# Altium project Linear Actuator V3.1.PrjPcb
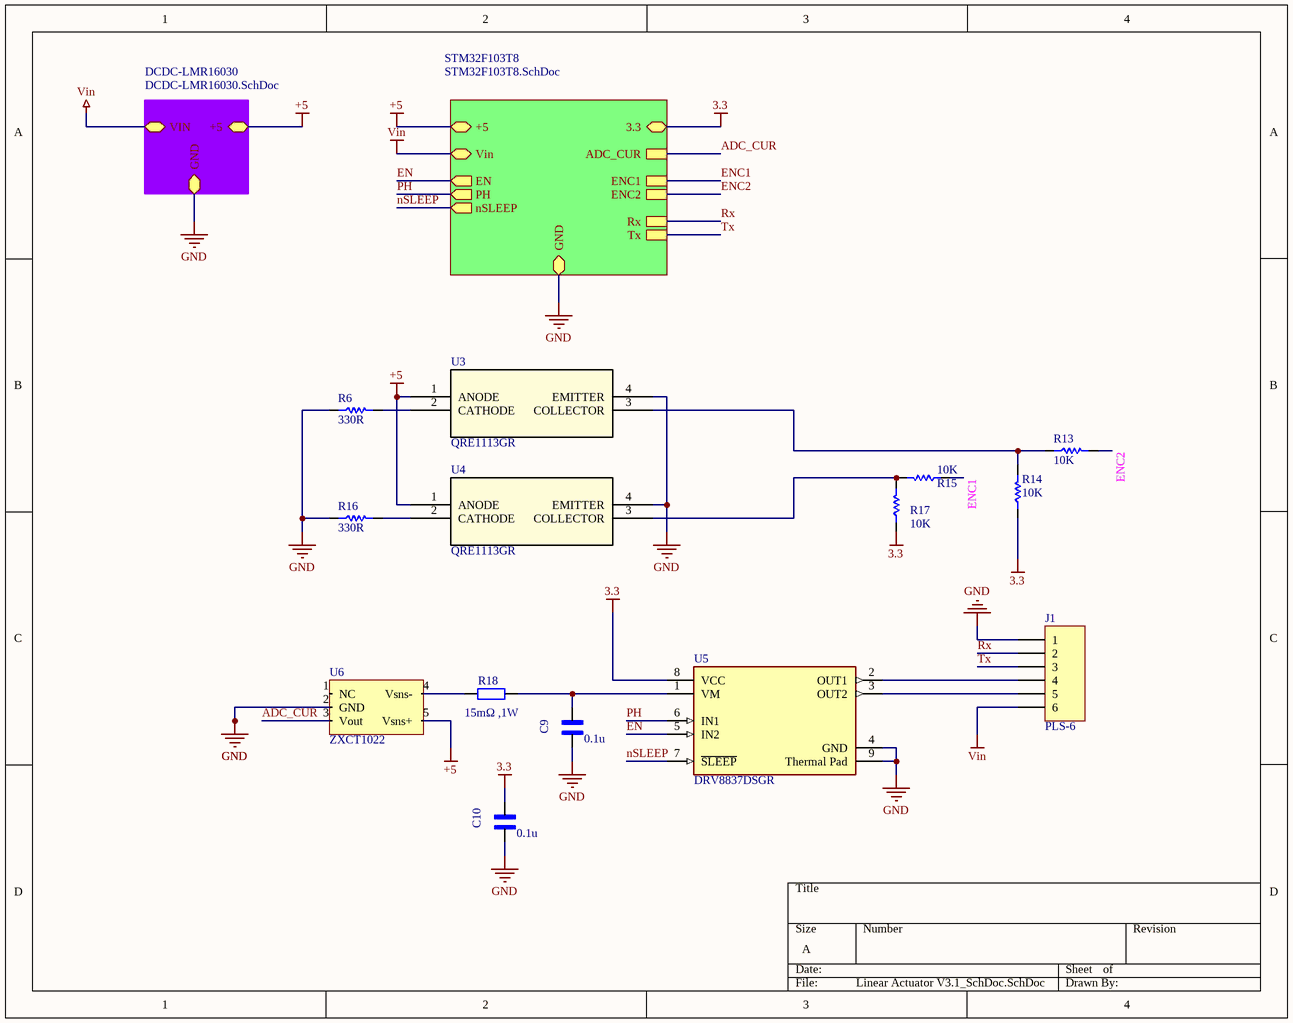
[diagram p0: Linear Actuator V3.1_SchDoc.SchDoc]
Date: 2/2/2022; Engineer: Ehsan Shaghaei
3 sheets, 50 parts. Net scope: hierarchical (ports join the sheet entries above them; power ports are global).
Board file: Linear Actuator V3.1_PcbDoc.PcbDoc
Sheets:
  Linear Actuator V3.1_SchDoc.SchDoc
    DCDC-LMR16030 = DCDC-LMR16030.SchDoc
    STM32F103T8 = STM32F103T8.SchDoc

## Sheet Linear Actuator V3.1_SchDoc.SchDoc
size A; SheetNumber: 1; SheetTotal: 3

### Parts
C9  value 0.1u  [*CAPC1608X90]  (hidden comment: GX035C104MAT2-500)
C10  value 0.1u  [*CAPC1608X90]  (hidden comment: GX035C104MAT2-500)
J1  PLS-6  [HDR Side 6 pin]
R6  330R  [RES 0603 (1608X06L)]
R13  10K  [RES 0603 (1608X06L)]
R14  10K  [RES 0603 (1608X06L)]
R15  10K  [RES 0603 (1608X06L)]
R16  330R  [RES 0603 (1608X06L)]
R17  10K  [RES 0603 (1608X06L)]
R18  value 15mΩ ,1W  [RES2512]  (hidden comment: resistor)
U3  QRE1113GR  [SMD4_2P90X3P60_ONS]
U4  QRE1113GR  [SMD4_2P90X3P60_ONS]
U5  DRV8837DSGR  [FP-DSG0008A-MFG]
U6  ZXCT1022  [SOT23-5]

### Sub-sheets
DCDC-LMR16030 = DCDC-LMR16030.SchDoc: GND (bidir), VIN (bidir), +5 (bidir)
STM32F103T8 = STM32F103T8.SchDoc: GND (bidir), +5 (bidir), 3.3 (bidir), Vin (bidir), ADC_CUR, ENC1, ENC2, EN (out), PH (out), nSLEEP (out), Rx, Tx

### Nets
3.3: C10.1 R14.1 R17.1 U5.8(VCC) ; sheet STM32F103T8/3.3
+5: U3.1(ANODE) U4.1(ANODE) U6.5(Vsns+) ; sheet DCDC-LMR16030/+5, sheet STM32F103T8/+5
GND: C9.2 C10.2 J1.1 R6.1 R16.1 U3.4(EMITTER) U4.4(EMITTER) U5.4(GND) U5.9(Thermal_Pad) U6.2(GND) ; sheet DCDC-LMR16030/GND, sheet STM32F103T8/GND
Vin: J1.6 ; sheet DCDC-LMR16030/VIN, sheet STM32F103T8/Vin
ADC_CUR: U6.3(Vout) ; sheet STM32F103T8/ADC_CUR
EN: U5.5(IN2) ; sheet STM32F103T8/EN
ENC1: R15.1 ; sheet STM32F103T8/ENC1
ENC2: R13.2 ; sheet STM32F103T8/ENC2
nSLEEP: U5.7(~{SLEEP}) ; sheet STM32F103T8/nSLEEP
PH: U5.6(IN1) ; sheet STM32F103T8/PH
Rx: J1.2 ; sheet STM32F103T8/Rx
Tx: J1.3 ; sheet STM32F103T8/Tx
NetC9_1: C9.1 R18.2 U5.1(VM)
NetJ1_4: J1.4 U5.2(OUT1)
NetJ1_5: J1.5 U5.3(OUT2)
NetR6_2: R6.2 U3.2(CATHODE)
NetR13_1: R13.1 R14.2 U3.3(COLLECTOR)
NetR15_2: R15.2 R17.2 U4.3(COLLECTOR)
NetR16_2: R16.2 U4.2(CATHODE)
NetR18_1: R18.1 U6.4(Vsns-)

Not connected (* = marked no-connect by the designer): U6 1(NC)

### Library data of the parts
C9 C10 = GX035C104MAT2-500: Cap Thin Film 0.1uf 50v 0603; MF: AVX; MP: GX035C104MAT2-500 or CL10B104JB8NNNC; Pacage Metric: 1608; Type: SMD; Package: 0603 AVX; SnapEDA_Link: https://www.snapeda.com/parts/GX035C104MAT2-500/AVX/view-part/?ref=snap
J1 = PLS-6: PLS-6 (DS1021-1x6), Вилка штыревая 2.54мм 1x6 прямая тип1; Instructions: DNP; ChipDip_Link: https://www.chipdip.ru/product/pls-6; MP: PLS-6; Type: SMD
R6 R13-R17 = Resistor: Tolerance: 5%; Power: 1/8 W
  R6 R16: Value: 330R
  R13-R15 R17: Value: 10K
U3 U4 = QRE1113GR: No Description Available; Vendor: ON Semiconductor; Built_By: Ehsan Shaghaei; SourceLibrary: ON_Semiconductor_2019-12-30; Manufacturer_Part_Number: QRE1113GR; Copyright: Copyright (C) 2018 Accelerated Designs. All rights reserved; RefDes: RefDes; Type: DEV; ComponentLink1Description: New link; ComponentLink1URL: *; ChipDip_Link: https://www.chipdip.ru/product/qre1113gr-fairchild
U5 = CMP-04915-000004-1: IC MOTOR DRIVER PAR 8WSON; Manufacturer: Texas Instruments; Switching Frequency: 0-250kHz; Min Supply Voltage: 1.8V; Standoff Height: 0mm; Max Supply Voltage: 7V; Output Voltage: 0-11V; Motor Type: Brushed; Number Of Outputs: 2; Output Current: 1.8A; Max Junction Temp: +150°C; Nominal Supply Current: 300-700uA; Mouser Description: Motor / Motion / Ignition Controllers & Drivers 1.8A Low Vltg Brush DC Motor Driver; Device Class L2: Power Management ICs; Manufacturer Part Number: DRV8837DSGR; Temperature Range Low: -40°C; Lead Free: Yes; Height: 0.8mm; Device Class L3: Motor Drivers; Octopart: https://octopart.com/drv8837dsgr-texas+instruments-23786726; Package: DSG0008A; ComponentLink2URL: https://www.chipdip.ru/product0/8004320325; Temperature: -40°C to +85°C; Ambient Temperature Range Low: -40°C; ComponentLink2Description: ChipDip_Link; Ambient Temperature Range High: +85°C; Device Class L1: Integrated Circuits (ICs); Category: IC; Temperature Range High: +85°C; RoHS: TRUE; Automotive: No; Digikey Description: IC MOTOR DRIVER PAR 8WSON; ComponentLink3Description: HelpURL; ComponentLink3URL: http://www.ti.com/lit/ds/symlink/drv8837.pdf
R18 = resistor: Published: 8-Jun-2000; LatestRevisionDate: 17-Jul-2002; LatestRevisionNote: Re-released for DXP Platform.; PackageReference: AXIAL-0.4; Publisher: Altium Limited
U6 = ZXCT1022: HelpURL: https://static.chipdip.ru/lib/465/DOC012465896.pdf; Chipdip_Link: https://www.chipdip.ru/product/zxct1022e5ta-current-sense-monitor-2.5

## Sheet DCDC-LMR16030.SchDoc
size A3; Engineer: Ehsan Shaghaei; Revision: 9; SheetNumber: 3; SheetTotal: 3
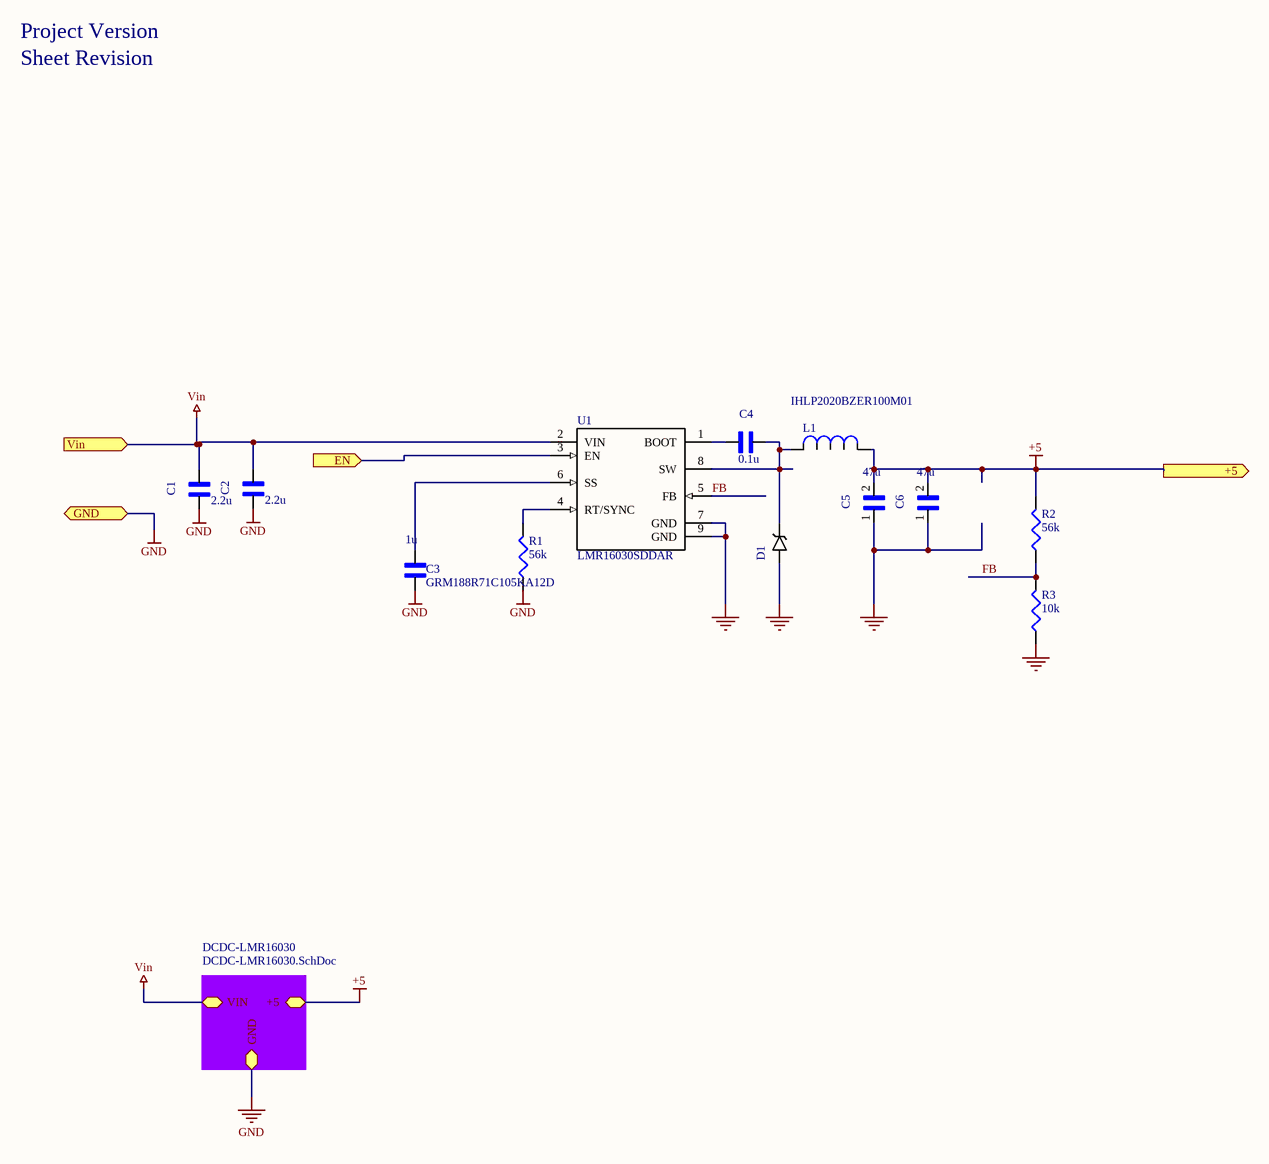
[diagram p1: DCDC-LMR16030.SchDoc]

### Parts
(Parts that share a designator on the sheet are numbered #1, #2 ... from top to bottom, then left to right.)
C1#1  value 2.2u  [*CAP3216X125N]  (hidden comment: GRM31CR71H225KA88L)
C2#1  value 2.2u  [*CAP3216X125N]  (hidden comment: GRM31CR71H225KA88L)
C3#1  GRM188R71C105KA12D  value 1u  [CAPC1608X90N]
C4#1  value 0.1u  [*CAPC1608X90]  (hidden comment: GX035C104MAT2-500)
C5#1  value 47u  [*CAPC3216X125N]  (hidden comment: GRM31CR61A476KE15L)
C6#1  value 47u  [*CAPC3216X125N]  (hidden comment: GRM31CR61A476KE15L)
D1#1  SK56  [*SMB_P6SMB62AT3G(Primary)]  (value not drawn)
L1  IHLP2020BZER100M01  [IHLP]
R1  value 56k  [J1-0603]  (hidden comment: Res3)
R2  value 56k  [J1-0603]  (hidden comment: Res3)
R3  value 10k  [J1-0603]  (hidden comment: RC0603FR-0710KL)
U1#1  LMR16030SDDAR  [*SOIC127P600X170-9N - duplicate]

### Sub-sheets
DCDC-LMR16030 = DCDC-LMR16030.SchDoc: GND (bidir), VIN (bidir), +5 (bidir)

### Ports
+5 (out), EN (in), GND (bidir), Vin (in)

### Nets
+5: C5#1.2 C6#1.2 L1.1 R2.2 ; port +5, sheet DCDC-LMR16030/+5
GND: C1#1.2 C2#1.2 C3#1.1 C5#1.1 C6#1.1 D1#1.A R1.1 R3.1 U1#1.7(GND) U1#1.9(GND) ; port GND, sheet DCDC-LMR16030/GND
Vin: C1#1.1 C2#1.1 U1#1.2(VIN) ; port Vin, sheet DCDC-LMR16030/VIN
FB: R2.1 R3.2 U1#1.5(FB)
NetC3#1_2: C3#1.2 U1#1.6(SS)
NetC4#1_1: C4#1.1 D1#1.C L1.2 U1#1.8(SW)
NetC4#1_2: C4#1.2 U1#1.1(BOOT)
NetR1_2: R1.2 U1#1.4(RT/SYNC)
NetU1#1_3: U1#1.3(EN) ; port EN

### Notes on the sheet
- Project Version
- Sheet Revision

### Library data of the parts
C1#1 C2#1 = GRM31CR71H225KA88L: 1206 2.2 uF 50 V В±10% Tolerance X7R SMT Multilayer Ceramic Capacitor; MF: Murata Electronics; Type: SMD; Package: 1206 Murata; SnapEDA_Link: https://www.snapeda.com/parts/GRM31CR71H225KA88L/Murata%20Electronics%20North%20America/view-part/?ref=snap; MP: GRM31CR71H225KA88L
C3#1 = GRM188R71C105KA12D: SMD Capacitor X7R(EIA) with Capacitance: 1.0uF Tol. 10%. Rated Voltage: 16Vdc; MF: Murata Electronics; Pacage Metric: 1608; MP: GRM188R71C105KA12D; SnapEDA_Link: https://www.snapeda.com/parts/GRM188R71C105KA12D/Murata%20Electronics%20North%20America/view-part/228340/?ref=snap; Package: 0603; ChipDip_Link: https://www.chipdip.ru/product/grm188r71c105ka12d; HelpURL: https://static.chipdip.ru/lib/428/DOC005428493.pdf; Type: SMD
C4#1 = GX035C104MAT2-500: as C9 on sheet Linear Actuator V3.1_SchDoc; Package: 0603 AVX; SnapEDA_Link: https://www.snapeda.com/parts/GX035C104MAT2-500/AVX/view-part/?ref=snap
C5#1 C6#1 = GRM31CR61A476KE15L: Multilayer Ceramic Capacitor, GRM Series, 47 - F, - 10%, X5R, 10 V, 1206 [3216 Metric]; MF: Murata Electronics; Type: SMD; Package: 1206 Murata Electronics; MP: GRM31CR61A476KE15L; SnapEDA_Link: https://www.snapeda.com/parts/GRM31CR61A476KE15L/Murata%20Electronics%20North%20America/view-part/?ref=snap
D1#1 = SK56: Диод Шоттки 5А 60В [SMB / DO-214AA]; MF: Littelfuse Inc.; Type: SMD; MP: SK56; Package: DO-214 Littelfuse; SnapEDA_Link: https://www.snapeda.com/parts/P6SMB62AT3G/Littelfuse%20Inc./view-part/?ref=snap; Value: *; ChipDip_Link: https://www.chipdip.ru/product/sk56
L1 = IHLP2020BZER100M01: 10ÂµH Shielded Molded Inductor 2.3A 199mOhm Max Nonstandard; MF: Vishay Dale; Type: SMD; SnapEDA_Link: https://www.snapeda.com/parts/IHLP2020BZER100M01/Vishay%20Dale/view-part/44808/?ref=snap; MP: IHLP2020BZER100M01; Value: *; Package: Nonstandard Vishay; HelpURL: http://www.vishay.com/docs/34253/ihlp-2020bz-01.pdf; ChipDip_Link: https://www.chipdip.ru/product/ihlp2020bzer100m11-inductor-ihlp-smd-2020-10
R1 R2 = Res3: Resistor; Pacage Metric: 1608; MP: RC0603FR-0756KL; ChipDip_Link: https://www.chipdip.ru/product0/9000079754; HelpURL: https://www.chipdip.ru/product0/9000079754; Package: R0603; Type: SMD
R3 = RC0603FR-0710KL: 10 kOhms 1 0.1 W 1 10 W Chip Resistor 0603 1608 Metric Thick Film; Pacage Metric: 1608; MF: Yageo or NXP; MP: 10K 1% 0603; ChipDip_Link: https://www.chipdip.ru/product0/9000079736; HelpURL: https://www.chipdip.ru/product0/9000079736; Package: R0603; Type: SMD; SnapEDA_Link: https://www.snapeda.com/parts/RC0603FR-0710KL/Yageo/view-part/?ref=dk&t=RC0603FR-0710KL&con_ref=None
U1#1 = LMR16030SDDAR: LMR16030SDDAR, Conv DC-DC 4.3V to 60V Step Down Single-Out 1V to 50V 3A Automotive 8-Pin HSOP EP T/R; MF: Texas Instruments; SnapEDA_Link: https://www.snapeda.com/parts/TPS54560DDA/Texas%20Instruments/view-part/?ref=snap; MP: LMR16030SDDAR; Package: PowerSOIC-8 Texas Instruments; Value: *; Type: SMD; ChipDip_Link: https://www.chipdip.ru/product1/8003448566; HelpURL: https://www.ti.com/lit/ds/symlink/lmr16030.pdf

## Sheet STM32F103T8.SchDoc
size A3; Revision: 10; SheetNumber: 3; SheetTotal: 3
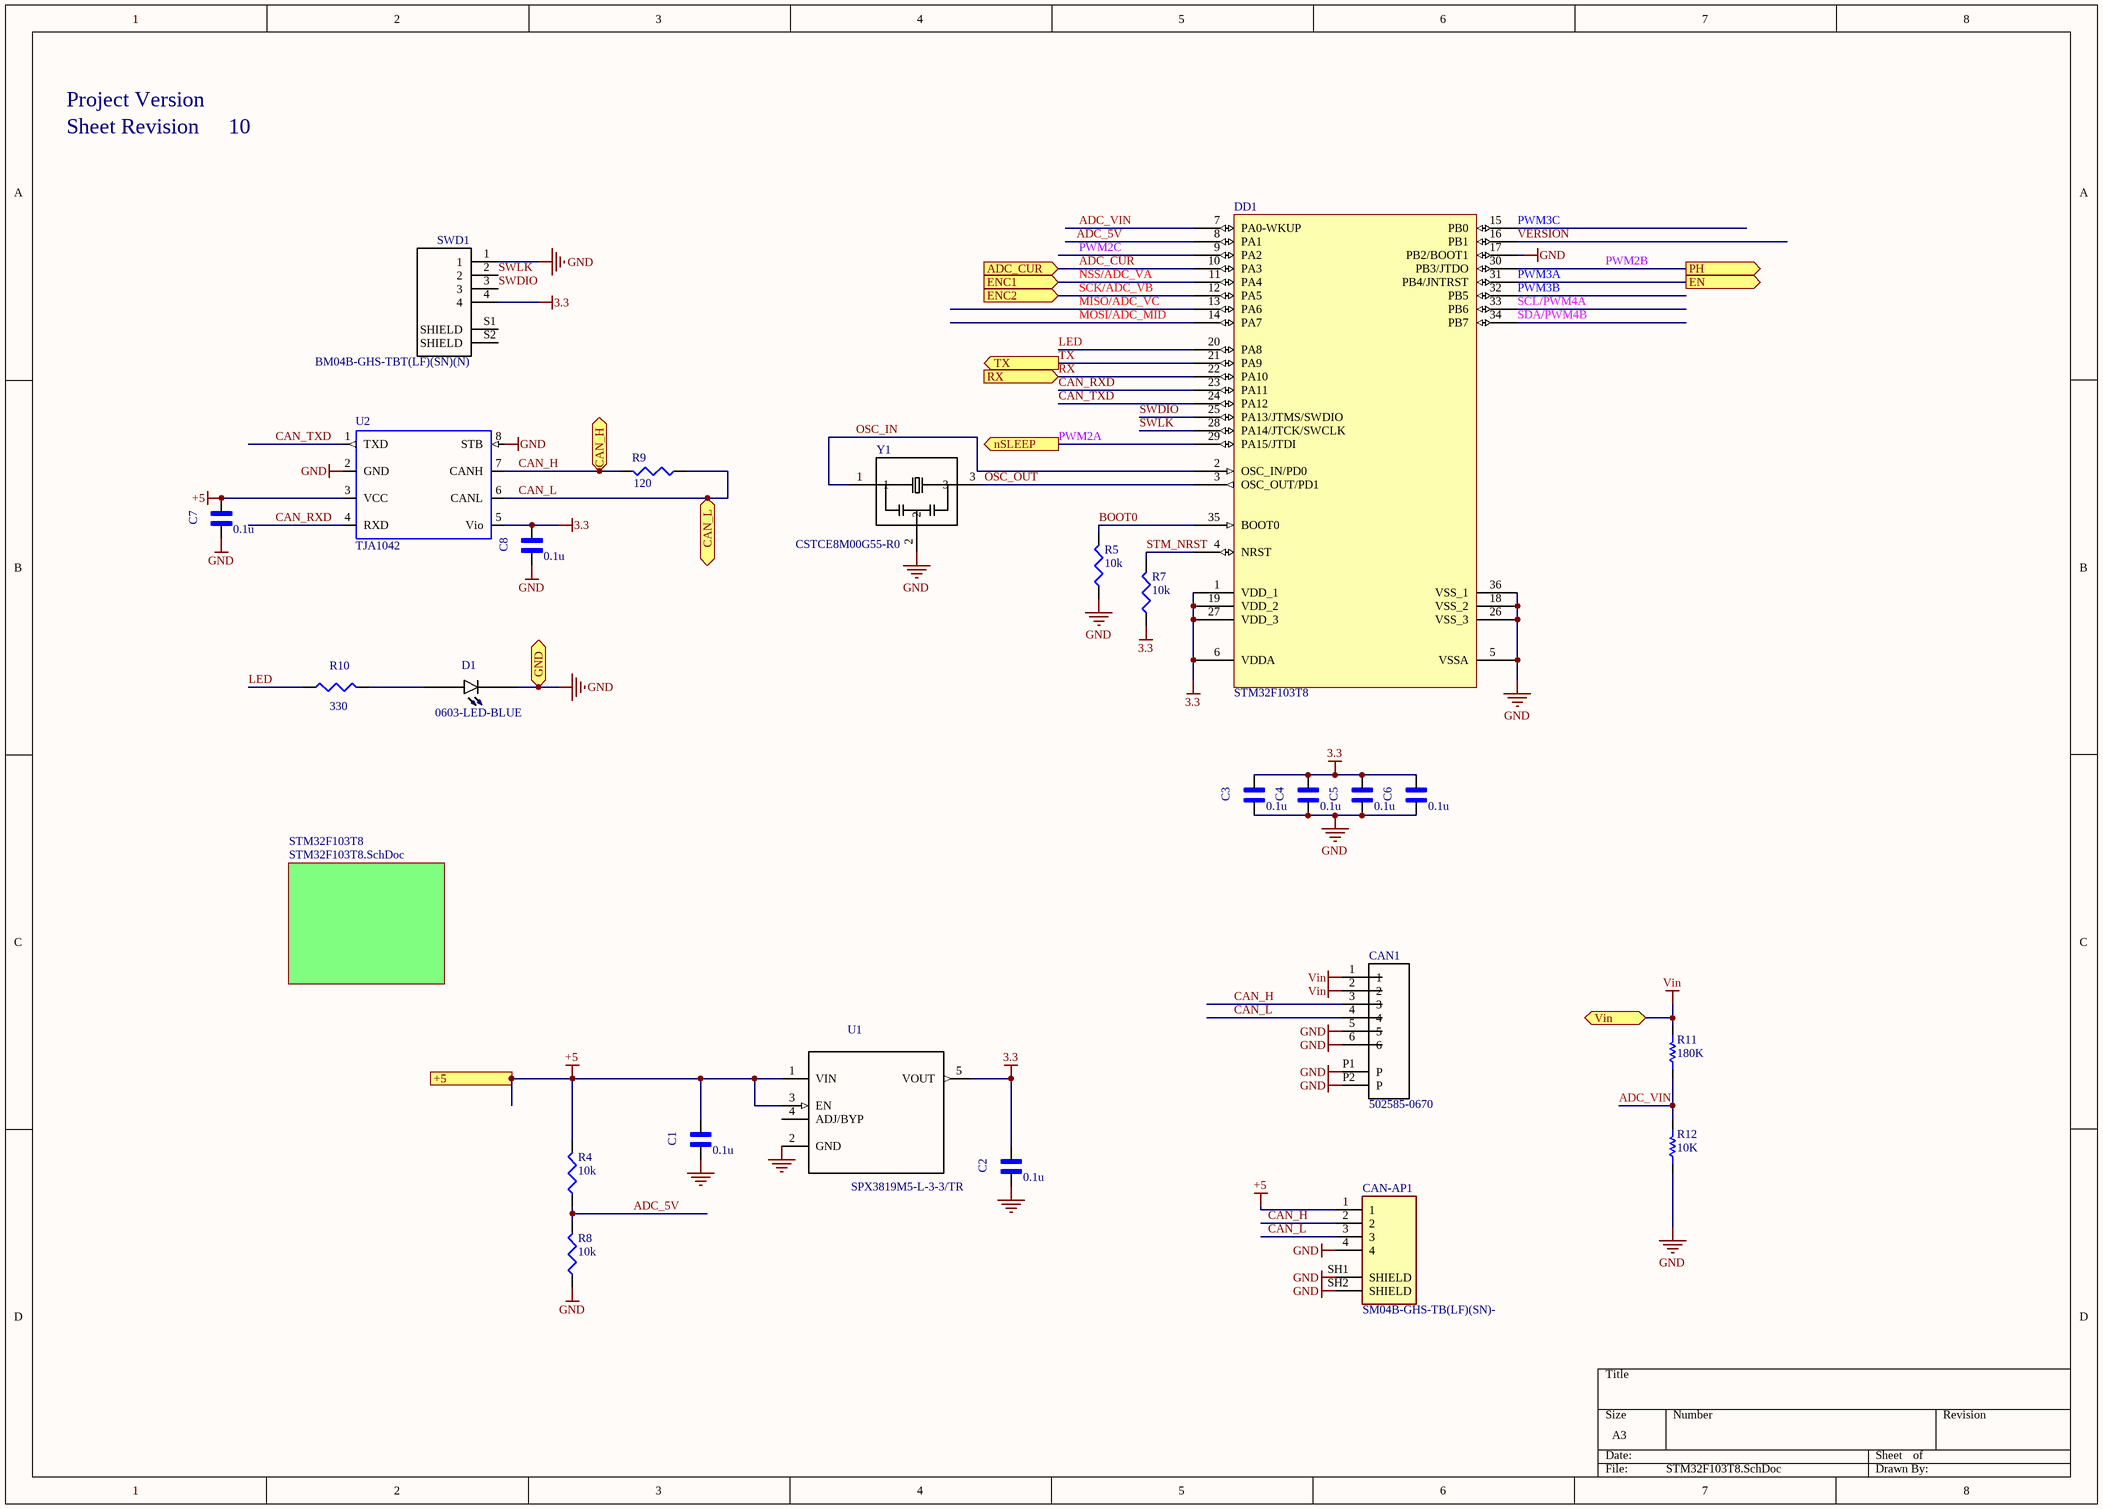
[diagram p2: STM32F103T8.SchDoc]

### Parts
(Parts that share a designator on the sheet are numbered #1, #2 ... from top to bottom, then left to right.)
C1#2  value 0.1u  [*CAPC1608X90]  (hidden comment: GX035C104MAT2-500)
C2#2  value 0.1u  [*CAPC1608X90]  (hidden comment: GX035C104MAT2-500)
C3#2  value 0.1u  [*CAPC1608X90]  (hidden comment: GX035C104MAT2-500)
C4#2  value 0.1u  [*CAPC1608X90]  (hidden comment: GX035C104MAT2-500)
C5#2  value 0.1u  [*CAPC1608X90]  (hidden comment: GX035C104MAT2-500)
C6#2  value 0.1u  [*CAPC1608X90]  (hidden comment: GX035C104MAT2-500)
C7  value 0.1u  [*CAPC1608X90]  (hidden comment: GX035C104MAT2-500)
C8  value 0.1u  [*CAPC1608X90]  (hidden comment: GX035C104MAT2-500)
CAN1  502585-0670  [MOLEX_502585-0670]
CAN-AP1  SM04B-GHS-TB(LF)(SN)-  [JST_SM04B-GHS-TB(LF)(SN)-]
D1#2  0603-LED-BLUE  [*LEDM1608X80_LTE-C1906R-14(Primary)]
DD1  STM32F103T8  [*QFN50P600X600X100-37N]
R4  value 10k  [J1-0603]  (hidden comment: RC0603FR-0710KL)
R5  value 10k  [J1-0603]  (hidden comment: RC0603FR-0710KL)
R7  value 10k  [J1-0603]  (hidden comment: RC0603FR-0710KL)
R8  value 10k  [J1-0603]  (hidden comment: RC0603FR-0710KL)
R9  value 120  [J1-0603]  (hidden comment: Res3)
R10  value 330  [J1-0603]  (hidden comment: Res3)
R11  180K  [RES 0603 (1608X06L)]
R12  10K  [RES 0603 (1608X06L)]
SWD1  BM04B-GHS-TBT(LF)(SN)(N)  [JST_BM04B-GHS-holes]
U1#2  SPX3819M5-L-3-3/TR  [*SOT95P280X145-5N]
U2  TJA1042  [SOT782-1]
Y1  CSTCE8M00G55-R0  [*OSC_CSTCE8M00G55-R0]

### Sub-sheets
STM32F103T8 = STM32F103T8.SchDoc: no entries

### Ports
+5 (in), ADC_CUR (in), CAN_H (bidir), CAN_L (bidir), EN (out), ENC1 (in), ENC2 (in), GND (bidir), nSLEEP (out), PH (out), RX (in), TX (out), Vin (bidir)

### Nets
3.3: C2#2.1 C3#2.1 C4#2.1 C5#2.1 C6#2.1 C8.1 DD1.1(VDD_1) DD1.6(VDDA) DD1.19(VDD_2) DD1.27(VDD_3) R7.1 SWD1.4 U1#2.5(VOUT) U2.5(Vio)
+5: C1#2.1 C7.1 CAN-AP1.1 R4.2 U1#2.1(VIN) U1#2.3(EN) U2.3(VCC) ; port +5
GND: C1#2.2 C2#2.2 C3#2.2 C4#2.2 C5#2.2 C6#2.2 C7.2 C8.2 CAN1.5 CAN1.6 CAN1.P1(P) CAN1.P2(P) CAN-AP1.4 CAN-AP1.SH1(SHIELD) CAN-AP1.SH2(SHIELD) D1#2.C DD1.5(VSSA) DD1.17(PB2/BOOT1) DD1.18(VSS_2) DD1.26(VSS_3) DD1.36(VSS_1) R5.1 R8.1 R12.1 SWD1.1 U1#2.2(GND) U2.2(GND) U2.8(STB) Y1.2 ; port GND
Vin: CAN1.1 CAN1.2 R11.2 ; port Vin
ADC_5V: DD1.8(PA1) R4.1 R8.2
ADC_CUR: DD1.10(PA3) ; port ADC_CUR
ADC_VIN: DD1.7(PA0-WKUP) R11.1 R12.2
BOOT0: DD1.35(BOOT0) R5.2
CAN_H: CAN1.3 CAN-AP1.2 R9.2 U2.7(CANH) ; port CAN_H
CAN_L: CAN1.4 CAN-AP1.3 R9.1 U2.6(CANL) ; port CAN_L
CAN_RXD: DD1.23(PA11) U2.4(RXD)
CAN_TXD: DD1.24(PA12) U2.1(TXD)
LED: DD1.20(PA8) R10.1
MISO/ADC_VC: DD1.13(PA6)
MOSI/ADC_MID: DD1.14(PA7)
NSS/ADC_VA: DD1.11(PA4) ; port ENC1  [project net ENC1]
OSC_IN: DD1.2(OSC_IN/PD0) Y1.1
OSC_OUT: DD1.3(OSC_OUT/PD1) Y1.3
PWM2A: DD1.29(PA15/JTDI) ; port nSLEEP  [project net nSLEEP]
PWM2B: DD1.30(PB3/JTDO) ; port PH  [project net PH]
PWM2C: DD1.9(PA2)
PWM3A: DD1.31(PB4/JNTRST) ; port EN  [project net EN]
PWM3B: DD1.32(PB5)
PWM3C: DD1.15(PB0)
Rx: DD1.22(PA10) ; port RX
SCK/ADC_VB: DD1.12(PA5) ; port ENC2  [project net ENC2]
SCL/PWM4A: DD1.33(PB6)
SDA/PWM4B: DD1.34(PB7)
STM_NRST: DD1.4(NRST) R7.2
SWDIO: DD1.25(PA13/JTMS/SWDIO) SWD1.3
SWLK: DD1.28(PA14/JTCK/SWCLK) SWD1.2
Tx: DD1.21(PA9) ; port TX
VERSION: DD1.16(PB1)
NetD1#2_A: D1#2.A R10.2

Not connected (* = marked no-connect by the designer): SWD1 S1(SHIELD) S2(SHIELD); U1#2 4(ADJ/BYP)

### Notes on the sheet
- Project Version
- Sheet Revision

### Library data of the parts
C1#2 C2#2 = GX035C104MAT2-500: Cap Thin Film 0.1uf 50v 0603; MF: AVX; Pacage Metric: 1608; Type: SMD; Package: 0603 AVX; MP: GX035C104MAT2-500; SnapEDA_Link: https://www.snapeda.com/parts/GX035C104MAT2-500/AVX/view-part/?ref=snap
C3#2 C4#2 C5#2 C6#2 C7 C8 = GX035C104MAT2-500: as C9 on sheet Linear Actuator V3.1_SchDoc; Package: 0603 AVX; SnapEDA_Link: https://www.snapeda.com/parts/GX035C104MAT2-500/AVX/view-part/?ref=snap
CAN1 = 502585-0670: 1.50mm Pitch, CLIK-Mate PCB Receptacle, Single Row, Surface Mount, Right-Angle, Tin Plating, Positive Lock, 6 Circuits, Natural; MF: Molex; System: Connector; MP: 502585-0670; Package: None; SnapEDA_Link: https://www.snapeda.com/parts/502494-0670/Molex/view-part/?ref=snap; Value: *; Type: SMD
CAN-AP1 = SM04B-GHS-TB(LF)(SN)-: Connector Header Surface Mount, Right Angle 4 position 0.049 _1.25mm_; MF: JST Sales; MP: SM04B-GHS-TB(LF)(SN); Package: None; Value: *; SnapEDA_Link: https://www.snapeda.com/parts/SM04B-GHS-TB%28LF%29%28SN%29-/JST%20Sales%20America%20Inc./view-part/2759740/?ref=snap; HelpURL: http://www.farnell.com/datasheets/2082975.pdf; System: Connector; ChipDip_Link: https://www.chipdip.ru/product/sm04b-ghs-tb-lf-sn-gh-1.25mm-header-side-ent
D1#2 = LTE-C1906R-14: LED IrLED Chip LED 2-Pin SMD T/R; SOMEPARAMETER: SOMEVALUE; Package: 0603 Lite-On; MP: 0603-LED-BLUE; SnapEDA_Link: https://www.snapeda.com/parts/LTE-C1906R-14/Lite-On%20Inc./view-part/?ref=snap; Value: *; Type: SMD
DD1 = STM32F103T8: STM32F103T8U6, Микроконтроллер 32BIT ARM 64K FLASH [VFQFPN-36]; MF: STM; ChipDip_Link: https://www.chipdip.ru/product/stm32f103t8u6-2; HelpURL: http://www.st.com/stonline/products/literature/ds/13587.pdf; MP: STM32F103T8U6; Package: VFQFPN-36; SnapEDA_Link: https://www.snapeda.com/parts/STM32F103T8U6TR/STMicroelectronics/view-part/?ref=search&t=STM32F103T8U6; Type: SMD
R4 R5 R7 R8 = RC0603FR-0710KL: as R3 on sheet DCDC-LMR16030; ChipDip_Link: https://www.chipdip.ru/product0/9000079736; HelpURL: https://www.chipdip.ru/product0/9000079736; Package: R0603; Type: SMD; SnapEDA_Link: https://www.snapeda.com/parts/RC0603FR-0710KL/Yageo/view-part/?ref=dk&t=RC0603FR-0710KL&con_ref=None
R9 = Res3: 120 Ohms 1 0.1 W 1 10 W Chip Resistor 0603 1608 Metric Thick Film; Pacage Metric: 1608; MP: RC0603FR-07120RL; ChipDip_Link: https://www.chipdip.ru/product0/9000079618; HelpURL: https://www.chipdip.ru/product0/9000079618; Package: R0603; Type: SMD
R10 = Res3: Resistor; Pacage Metric: 1608; MP: RC0603FR-07330RL; ChipDip_Link: https://www.chipdip.ru/product0/9000079628; HelpURL: https://www.chipdip.ru/product0/9000079628; Package: R0603; Type: SMD
R11 R12 = Resistor: Tolerance: 5%; Power: 1/8 W
  R11: Value: 180K
  R12: Value: 10K
SWD1 = BM04B-GHS-TBT(LF)(SN)(N): Conn Shrouded Header HDR 4 POS 1.25mm Solder ST SMD Reel; MF: JST Sales; MP: SM04B-GHS-TB(LF)(SN); Instructions: Do not install; System: Connector; SnapEDA_Link: https://www.snapeda.com/parts/BM04B-GHS-TBT%28LF%29%28SN%29%28N%29/JST%20Sales%20America%20Inc./view-part/?ref=snap; Package: None; Value: *; Type: SMD
U1#2 = SPX3819M5-L: Low Dropout Voltage Regulator, Adjustable 0.5A, В±1%, 2.5 to 16 Vin, 5-Pin SOT-23; MF: MaxLinear, Inc.; Value: 3V3; MP: SPX3819M5-L-3-3/TR; Package: SOT-23-5 Exar; SnapEDA_Link: https://www.snapeda.com/parts/SPX3819M5-L/MaxLinear%2C%20Inc./view-part/?ref=snap; Type: SMD; ChipDip_Link: https://www.chipdip.ru/product1/8003455237; HelpURL: http://www.farnell.com/datasheets/2614478.pdf
U2 = TJA1042: 1/1 Transceiver Half CANbus 8-SO; MF: NXP USA; SnapEDA_Link: https://www.snapeda.com/parts/TJA1042/NXP%20USA%20Inc./view-part/900919/?ref=snap; Value: *; MP: TJA1042; Package: VDFN-8 NXP USA; ChipDip_Link: https://www.chipdip.ru/product1/8002840332; HelpURL: https://static.chipdip.ru/lib/583/DOC001583059.pdf; Type: SMD
Y1 = CSTCE8M00G55-R0: Ceramic Resonator 8MHz ??0.5% _Tol_ ??0.2% _Stability_ 33pF 40Ohm 3-Pin CSMD T/R; MF: Murata; MP: CSTCE8M00G55-R0; Package: SMD-3 Murata; SnapEDA_Link: https://www.snapeda.com/parts/CSTCE8M00G55-R0/Murata%20Electronics%20North%20America/view-part/?ref=snap; Value: *; ChipDip_Link: https://www.chipdip.ru/product1/8001783721; HelpURL: https://www.murata.com/en-eu/api/pdfdownloadapi?cate=&partno=CSTCE8M00G55-R0; Type: SMD

## Nets that join several sheets
3.3: Linear Actuator V3.1_SchDoc (C10.1 R14.1 R17.1 U5.8), STM32F103T8 (14 pins)
+5: Linear Actuator V3.1_SchDoc (U3.1 U4.1 U6.5), DCDC-LMR16030 (C5#1.2 C6#1.2 L1.1 R2.2), STM32F103T8 (7 pins)
GND: Linear Actuator V3.1_SchDoc (10 pins), DCDC-LMR16030 (10 pins), STM32F103T8 (29 pins)
Vin: Linear Actuator V3.1_SchDoc (J1.6), DCDC-LMR16030 (C1#1.1 C2#1.1 U1#1.2), STM32F103T8 (CAN1.1 CAN1.2 R11.2)
ADC_CUR: Linear Actuator V3.1_SchDoc (U6.3), STM32F103T8 (DD1.10)
EN: Linear Actuator V3.1_SchDoc (U5.5), STM32F103T8 (DD1.31)
ENC1: Linear Actuator V3.1_SchDoc (R15.1), STM32F103T8 (DD1.11)
ENC2: Linear Actuator V3.1_SchDoc (R13.2), STM32F103T8 (DD1.12)
nSLEEP: Linear Actuator V3.1_SchDoc (U5.7), STM32F103T8 (DD1.29)
PH: Linear Actuator V3.1_SchDoc (U5.6), STM32F103T8 (DD1.30)
Rx: Linear Actuator V3.1_SchDoc (J1.2), STM32F103T8 (DD1.22)
Tx: Linear Actuator V3.1_SchDoc (J1.3), STM32F103T8 (DD1.21)